# EAGLE board reprap (EAGLE 6.3)
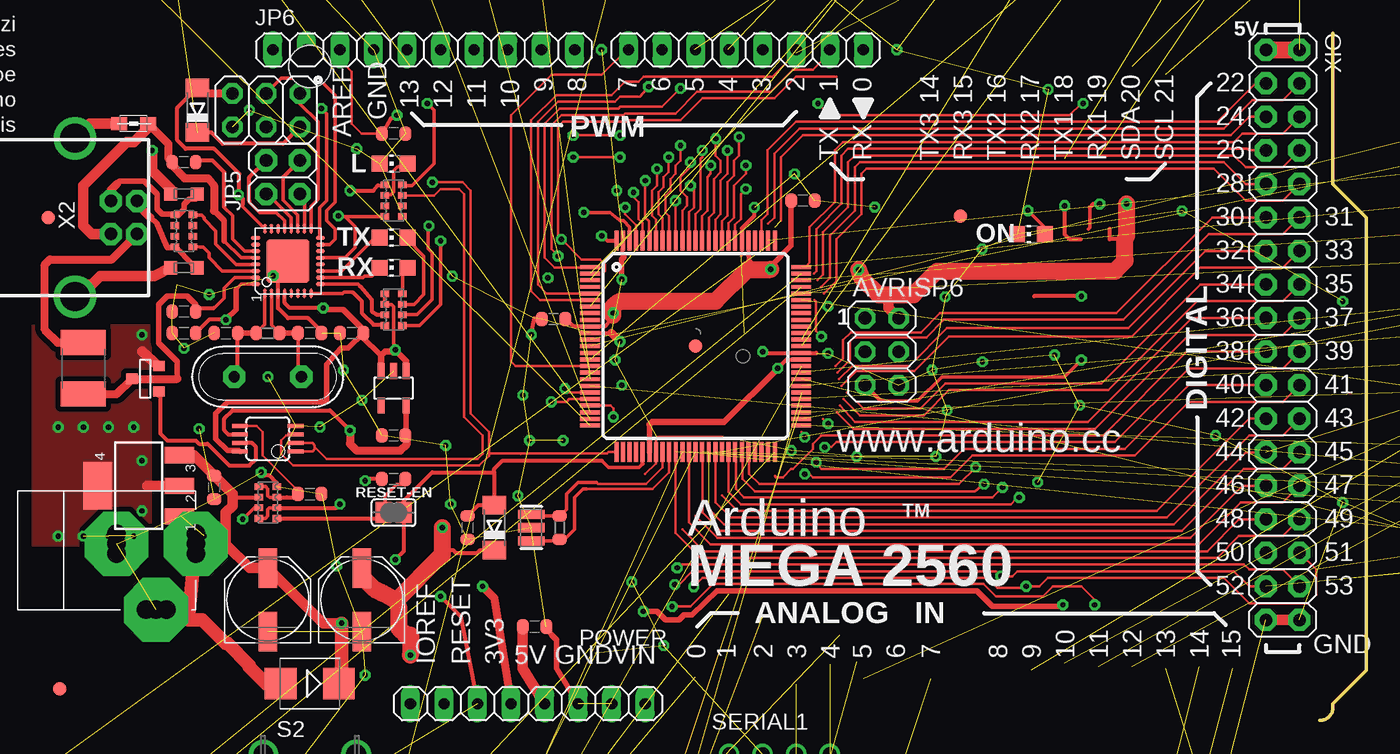
[diagram p5: board, top side]
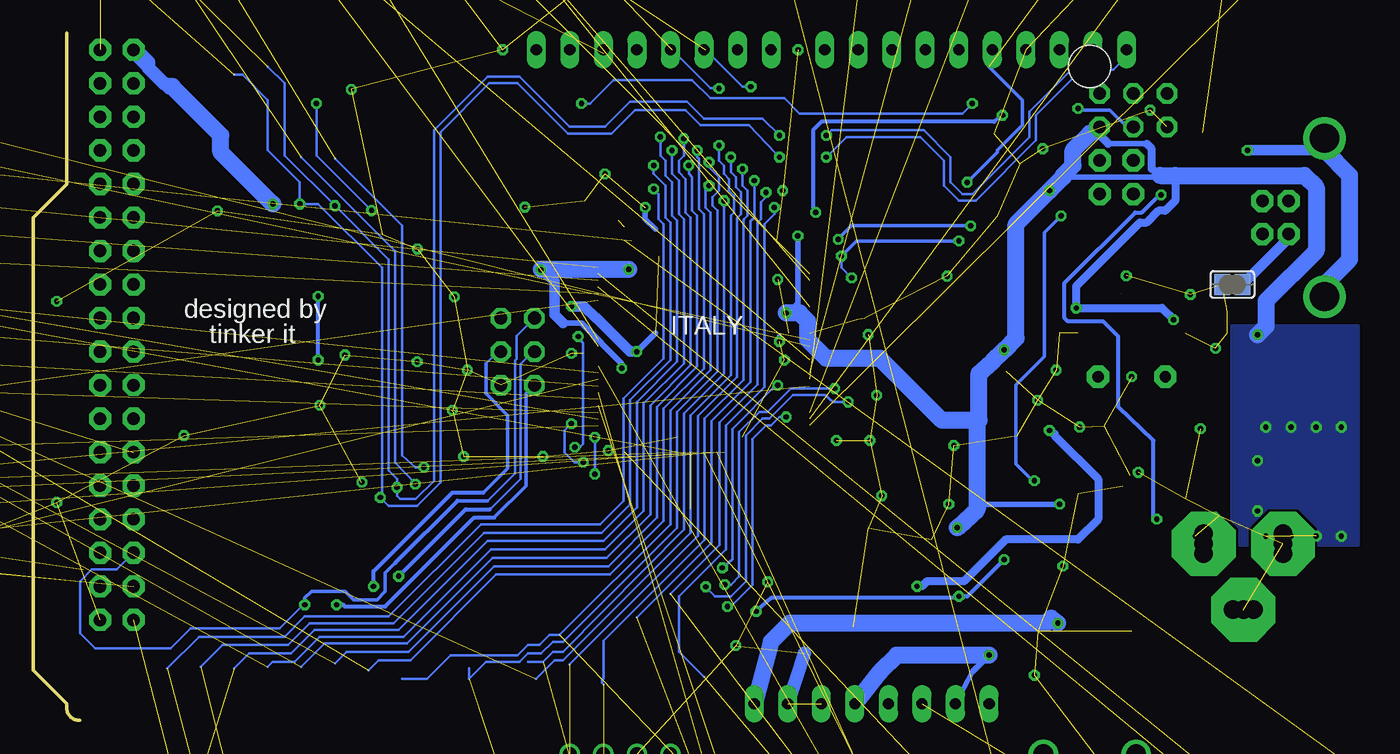
[diagram p6: board, bottom side, seen from below]

Size 3.54 x 52.07 mm. Coordinates in mm from the lower left corner, seen from the top.
Outline: 0,0 arc90 1,1 1,1.27 3.54,3.81 3.54,38.1 1,40.64 1,52.07
Copper layers (1*16): Top 0.035mm / dielectric 1.5mm / Bottom 0.035mm
Design rules "default": minimum track width 10mil, minimum drill 24mil, track to track 8mil, track to pad 8mil, pad to pad 8mil, via to via 8mil, smd to smd 8mil, copper to edge 40mil, drill to drill 8mil, minimum pad ring 10mil, minimum via ring 8mil, stop-mask expansion 4mil, vias tented up to drill 0mil, thermal gap 10mil
Net classes: 0 default: width 0.203 mm, drill 0.406 mm, clearance 0.203 mm; 1 power: width 0.61 mm, drill 0.406 mm, clearance 0.203 mm; 2 gnd: width 0.305 mm, drill 0.406 mm, clearance 0.203 mm; 3 power usb: width 0.508 mm, drill 0.406 mm, clearance 0.203 mm
Holes 3.2 mm at -76.47,49.53

## Footprints (pad centres in the part's own frame; a part is rotated, then mirrored left to right if it is on the bottom)
1X01 = drill 1.016 pad 1.93 octagon: 1 0,0
1X02 = drill 1.016 pad 1.88: 1 0,0; 2 2.54,0
1X04 = drill 1.016: 1 -2.54,0; 2 0,0; 3 2.54,0; 4 5.08,0
2X5 = drill 0.9 pad 1.422 octagon: 1 -3.81,-1.27; 2 -3.81,1.27; 3 -1.27,-1.27; 4 -1.27,1.27; 5 1.27,-1.27; 6 1.27,1.27; 7 3.81,-1.27; 8 3.81,1.27; 9 6.35,-1.27; 10 6.35,1.27
2X4 = drill 0.9 pad 1.422 octagon: 1 -3.81,-1.27; 2 -3.81,1.27; 3 -1.27,-1.27; 4 -1.27,1.27; 5 1.27,-1.27; 6 1.27,1.27; 7 3.81,-1.27; 8 3.81,1.27
1X18 = drill 1.016 pad 1.88 square: 1 0,0 | drill 1.016 pad 1.88: 2 2.54,0; 3 5.08,0; 4 7.62,0; 5 10.16,0; 6 12.7,0; 7 15.24,0; 8 17.78,0; 9 20.32,0; 10 22.86,0; 11 25.4,0; 12 27.94,0; 13 30.48,0; 14 33.02,0; 15 35.56,0; 16 38.1,0; 17 40.64,0; 18 43.18,0
2X03 = drill 0.95 pad 1.55 octagon: 1 -2.54,-1.27; 2 -2.54,1.27; 3 0,-1.27; 4 0,1.27; 5 2.54,-1.27; 6 2.54,1.27
C0603-ROUND = smd 0.898 x 1.1: 1 -0.889,0; 2 0.889,0
153CLV-0605 = smd 3.5 x 1.6: + 2.7,0; - -2.7,0
C0805 = smd 1.3 x 1.5: 1 -0.85,0; 2 0.85,0
153CLV-0405 = smd 2.6 x 1.6: + 1.8,0; - -1.8,0
SMB = smd 2.4 x 2.4: A 2.2,0; C -2.2,0
MINIMELF = smd 1.4 x 1.8: A 1.7,0; C -1.7,0
DO41-10 = drill 1.118: A 5.08,0; C -5.08,0
L1812 = smd 1.9 x 3.4: 1 -1.95,0; 2 1.95,0
MFR500 = drill 1.2 pad 2.3 long: 1 -5.08,0; 2 5.08,0
MFR1100 = drill 1.2 pad 2.3 long: 1 -5.08,0; 2 5.08,0
FIDUCIA-MOUNT = smd 1.016 x 1.016: P$1 0,0
SJ = smd 1.168 x 1.6: 1 -0.762,0; 2 0.762,0
SOT223 = smd 1.219 x 2.235: 1 -2.311,-3.099; 2 0,-3.099; 3 2.311,-3.099 | smd 3.6 x 2.2: 4 0,3.099
SO16 = smd 0.66 x 2.032: 1 -4.445,-3.073; 2 -3.175,-3.073; 3 -1.905,-3.073; 4 -0.635,-3.073; 5 0.635,-3.073; 6 1.905,-3.073; 7 3.175,-3.073; 8 4.445,-3.073; 9 4.445,3.073; 10 3.175,3.073; 11 1.905,3.073; 12 0.635,3.073; 13 -0.635,3.073; 14 -1.905,3.073; 15 -3.175,3.073; 16 -4.445,3.073
TQFP100 = smd 1.5 x 0.3: 1 -8,6; 2 -8,5.5; 3 -8,5; 4 -8,4.5; 5 -8,4; 6 -8,3.5; 7 -8,3; 8 -8,2.5; 9 -8,2; 10 -8,1.5; 11 -8,1; 12 -8,0.5; 13 -8,0; 14 -8,-0.5; 15 -8,-1; 16 -8,-1.5; 17 -8,-2; 18 -8,-2.5; 19 -8,-3; 20 -8,-3.5; 21 -8,-4; 22 -8,-4.5; 23 -8,-5; 24 -8,-5.5; 25 -8,-6; 51 8,-6; 52 8,-5.5; 53 8,-5; 54 8,-4.5; 55 8,-4; 56 8,-3.5; 57 8,-3; 58 8,-2.5; 59 8,-2; 60 8,-1.5; 61 8,-1; 62 8,-0.5; 63 8,0; 64 8,0.5; 65 8,1; 66 8,1.5; 67 8,2; 68 8,2.5; 69 8,3; 70 8,3.5; 71 8,4; 72 8,4.5; 73 8,5; 74 8,5.5; 75 8,6 | smd 0.3 x 1.5: 26 -6,-8; 27 -5.5,-8; 28 -5,-8; 29 -4.5,-8; 30 -4,-8; 31 -3.5,-8; 32 -3,-8; 33 -2.5,-8; 34 -2,-8; 35 -1.5,-8; 36 -1,-8; 37 -0.5,-8; 38 0,-8; 39 0.5,-8; 40 1,-8; 41 1.5,-8; 42 2,-8; 43 2.5,-8; 44 3,-8; 45 3.5,-8; 46 4,-8; 47 4.5,-8; 48 5,-8; 49 5.5,-8; 50 6,-8; 76 6,8; 77 5.5,8; 78 5,8; 79 4.5,8; 80 4,8; 81 3.5,8; 82 3,8; 83 2.5,8; 84 2,8; 85 1.5,8; 86 1,8; 87 0.5,8; 88 0,8; 89 -0.5,8; 90 -1,8; 91 -1.5,8; 92 -2,8; 93 -2.5,8; 94 -3,8; 95 -3.5,8; 96 -4,8; 97 -4.5,8; 98 -5,8; 99 -5.5,8; 100 -6,8
MLF32 = smd 0.7 x 0.28: 1 -2.45,1.75; 2 -2.45,1.25; 3 -2.45,0.75; 4 -2.45,0.25; 5 -2.45,-0.25; 6 -2.45,-0.75; 7 -2.45,-1.25; 8 -2.45,-1.75; 17 2.45,-1.75; 18 2.45,-1.25; 19 2.45,-0.75; 20 2.45,-0.25; 21 2.45,0.25; 22 2.45,0.75; 23 2.45,1.25; 24 2.45,1.75 | smd 0.28 x 0.7: 9 -1.75,-2.45; 10 -1.25,-2.45; 11 -0.75,-2.45; 12 -0.25,-2.45; 13 0.25,-2.45; 14 0.75,-2.45; 15 1.25,-2.45; 16 1.75,-2.45; 25 1.75,2.45; 26 1.25,2.45; 27 0.75,2.45; 28 0.25,2.45; 29 -0.25,2.45; 30 -0.75,2.45; 31 -1.25,2.45; 32 -1.75,2.45 | smd 3.254 x 3.254: 33 0,0
TQFP32-08 = smd 1.27 x 0.559: 1 -4.293,2.8; 2 -4.293,2; 3 -4.293,1.2; 4 -4.293,0.4; 5 -4.293,-0.4; 6 -4.293,-1.2; 7 -4.293,-2; 8 -4.293,-2.8; 17 4.293,-2.8; 18 4.293,-2; 19 4.293,-1.2; 20 4.293,-0.4; 21 4.293,0.4; 22 4.293,1.2; 23 4.293,2; 24 4.293,2.8 | smd 0.559 x 1.27: 9 -2.8,-4.293; 10 -2,-4.293; 11 -1.2,-4.293; 12 -0.4,-4.293; 13 0.4,-4.293; 14 1.2,-4.293; 15 2,-4.293; 16 2.8,-4.293; 25 2.8,4.293; 26 2,4.293; 27 1.2,4.293; 28 0.4,4.293; 29 -0.4,4.293; 30 -1.2,4.293; 31 -2,4.293; 32 -2.8,4.293
SOT23-DBV = smd 0.55 x 1.2: 1 -0.95,-1.3; 2 0,-1.3; 3 0.95,-1.3; 4 0.95,1.3; 5 -0.95,1.3
MSOP08 = smd 0.3 x 1.2: 1 -0.976,-2.113; 2 -0.326,-2.113; 3 0.324,-2.113; 4 0.974,-2.113; 5 0.974,2.112; 6 0.324,2.112; 7 -0.326,2.112; 8 -0.976,2.112
2X02 = drill 0.95 pad 1.676 octagon: 1 -1.27,-1.27; 2 -1.27,1.27; 3 1.27,-1.27; 4 1.27,1.27
1X10 = drill 0.85 pad 1.422 long: 1 -11.43,0; 2 -8.89,0; 3 -6.35,0; 4 -3.81,0; 5 -1.27,0; 6 1.27,0; 7 3.81,0; 8 6.35,0; 9 8.89,0; 10 11.43,0
2X03' = drill 1.016 octagon: 1 -2.54,-1.27; 2 -2.54,1.27; 3 0,-1.27; 4 0,1.27; 5 2.54,-1.27; 6 2.54,1.27
1X06 = drill 0.9 pad 1.422: 1 0,0; 2 2.54,0; 3 5.08,0; 4 7.62,0; 5 10.16,0; 6 12.7,0
CHIP-LED0805 = smd 1.2 x 1.2: A 0,-1.05; C 0,1.05
0805 = smd 1.2 x 1: 1 -1.1,0; 2 1.1,0
PANASONIC_D = smd 3 x 1.4: + 2.4,0; - -2.4,0
1X08 = drill 0.85 pad 1.422 long: 1 -8.89,0; 2 -6.35,0; 3 -3.81,0; 4 -1.27,0; 5 1.27,0; 6 3.81,0; 7 6.35,0; 8 8.89,0
TO220BV = drill 1.016 long: D 0,-2.54; G -2.54,-2.54; S 2.54,-2.54
R0603-ROUND = smd 0.898 x 1.1: 1 -0.889,0; 2 0.889,0
R0805 = smd 1.1 x 1.4: 1 -1,0; 2 1,0
R0805' = smd 1.3 x 1.5: 1 -0.85,0; 2 0.85,0
M0805 = smd 1.3 x 1.6: 1 -0.95,0; 2 0.95,0
CAY16 = smd 0.5 x 0.65: 1 -1.2,-0.675; 2 -0.4,-0.675; 3 0.4,-0.675; 4 1.2,-0.675; 5 1.2,0.675; 6 0.4,0.675; 7 -0.4,0.675; 8 -1.2,0.675
CAT16 = smd 0.5 x 0.65: 1 -1.2,-0.675; 2 -0.4,-0.675; 3 0.4,-0.675; 4 1.2,-0.675; 5 1.2,0.675; 6 0.4,0.675; 7 -0.4,0.675; 8 -1.2,0.675
B3F-31XX = drill 1.016 octagon: 1 -2.261,-1.245; 2 2.261,-1.245 | drill 1.499 pad 2.159: 3 -3.505,1.245; 4 3.505,1.245
3PIN-HEADER = drill 1.016: 1 -2.54,0; 2 0,0; 3 2.54,0
FE12 = drill 0.813 long: 1 -13.97,0; 2 -11.43,0; 3 -8.89,0; 4 -6.35,0; 5 -3.81,0; 6 -1.27,0; 7 1.27,0; 8 3.81,0; 9 6.35,0; 10 8.89,0; 11 11.43,0; 12 13.97,0
SOT-23 = smd 0.787 x 0.889: 1 0.025,-1.016; 2 -0.94,1.016; 3 0.991,1.016
ARDUINO_MEGA_SHIELD = drill 1 pad 1.422: 3.3V 50.8,26.67; 5V@0 50.8,29.21; 5V@1 2.54,85.09; 5V@2 2.54,87.63; A0 50.8,41.91; A1 50.8,44.45; A2 50.8,46.99; A3 50.8,49.53; A4 50.8,52.07; A5 50.8,54.61; A6 50.8,57.15; A7 50.8,59.69; A8 50.8,64.77; A9 50.8,67.31; A10 50.8,69.85; A11 50.8,72.39; A12 50.8,74.93; A13 50.8,77.47; A14 50.8,80.01; A15 50.8,82.55; AREF 2.54,14.986; D2 2.54,49.53; D3 2.54,46.99; D4 2.54,44.45; D5 2.54,41.91; D6 2.54,39.37; D7 2.54,36.83; D8 2.54,32.766; D9 2.54,30.226; D10 2.54,27.686; D11 2.54,25.146; D12 2.54,22.606; D13 2.54,20.066; D14 2.54,59.69; D15 2.54,62.23; D16 2.54,64.77; D17 2.54,67.31; D18 2.54,69.85; D19 2.54,72.39; D20 2.54,74.93; D21 2.54,77.47; D22 5.08,85.09; D23 5.08,87.63; D24 7.62,85.09; D25 7.62,87.63; D26 10.16,85.09; D27 10.16,87.63; D28 12.7,85.09; D29 12.7,87.63; D30 15.24,85.09; D31 15.24,87.63; D32 17.78,85.09; D33 17.78,87.63; D34 20.32,85.09; D35 20.32,87.63; D36 22.86,85.09; D37 22.86,87.63; D38 25.4,85.09; D39 25.4,87.63; D40 27.94,85.09; D41 27.94,87.63; D42 30.48,85.09; D43 30.48,87.63; D44 33.02,85.09; D45 33.02,87.63; D46 35.56,85.09; D47 35.56,87.63; D48 38.1,85.09; D49 38.1,87.63; D50 40.64,85.09; D51 40.64,87.63; D52 43.18,85.09; D53 43.18,87.63; GND@0 50.8,31.75; GND@1 50.8,34.29; GND@2 2.54,17.526; GND@3 45.72,85.09; GND@4 45.72,87.63; RES 50.8,24.13; RX 2.54,54.61; TX 2.54,52.07; VIN 50.8,36.83 | hole 3.2: 2.54,81.28; 50.8,87.63; 50.8,6.35
282837-6 = drill 1.2 long: P$1 0,-12.7; P$2 0,-7.62; P$3 0,-2.54; P$4 0,2.54; P$5 0,7.62; P$6 0,12.7
A4988BREAKOUT = drill 0.9: 1A 8.89,1.27; 1B 11.43,1.27; 2A 6.35,1.27; 2B 3.81,1.27; DIR 16.51,-11.43; EN -1.27,-11.43; GND 16.51,1.27; GND@0 1.27,1.27; MS1 1.27,-11.43; MS2 3.81,-11.43; MS3 6.35,-11.43; RST 8.89,-11.43; SLP 11.43,-11.43; STEP 13.97,-11.43; VDD 13.97,1.27; VMOT -1.27,1.27
POWERSUPPLY_DC-21MM = drill 1.4 pad 4.826 octagon: 1 -5.08,-3.353; 2 -0.076,-6.35; 3 -0.076,-0.356 | drill 1.4: 4 -5.08,-4.115; 5 -5.08,-2.591; 6 -0.838,-0.356; 7 0.686,-0.356; 8 -0.838,-6.35; 9 0.686,-6.35
PN61729 = drill 0.95 pad 1.676 octagon: 1 1.25,4.71; 2 -1.25,4.71; 3 -1.25,2.71; 4 1.25,2.71 | drill 2.2: P$1 -6,0; P$2 6,0
MSTBA4 = drill 1.397 long: 1 -7.62,5.08; 2 -2.54,5.08; 3 2.54,5.08; 4 7.62,5.08
2X18 = drill 0.95 pad 1.676 octagon: 1 -21.59,-1.27; 2 -21.59,1.27; 3 -19.05,-1.27; 4 -19.05,1.27; 5 -16.51,-1.27; 6 -16.51,1.27; 7 -13.97,-1.27; 8 -13.97,1.27; 9 -11.43,-1.27; 10 -11.43,1.27; 11 -8.89,-1.27; 12 -8.89,1.27; 13 -6.35,-1.27; 14 -6.35,1.27; 15 -3.81,-1.27; 16 -3.81,1.27; 17 -1.27,-1.27; 18 -1.27,1.27; 19 1.27,-1.27; 20 1.27,1.27; 21 3.81,-1.27; 22 3.81,1.27; 23 6.35,-1.27; 24 6.35,1.27; 25 8.89,-1.27; 26 8.89,1.27; 27 11.43,-1.27; 28 11.43,1.27; 29 13.97,-1.27; 30 13.97,1.27; 31 16.51,-1.27; 32 16.51,1.27; 33 19.05,-1.27; 34 19.05,1.27; 35 21.59,-1.27; 36 21.59,1.27
RESONATOR = smd 0.7 x 2: 1 -1,0; 2 0,0; 3 1,0
QS = drill 0.85 pad 1.676 octagon: 1 -2.54,0; 2 2.54,0
CT/CN0603 = smd 1 x 1: 1 -1,0; 2 1,0

## Placement (x,y rotation side)
5V1  [1X01]  -100.6,80.01 0 top  (outside the outline)
12V-AUX1  [1X02]  -94.25,87.63 0 top  (outside the outline)
A-OUT1  [1X04]  -38.37,55.88 0 top  (outside the outline)
AUX-2  M05X2  [2X5]  32.75,34.29 0 top  (outside the outline)
AUX-3  M04X2  [2X4]  35.29,15.24 0 top  (outside the outline)
AUX-4  M18_  [1X18]  23.86,5.08 90 top  (outside the outline)
AVRISP6  3x2M  [2X03]  -33.16,27.94 270 top  (outside the outline)
C1  22p  [C0603-ROUND]  -64.53,14.6 270 top  (outside the outline)
C2  100n  [C0603-ROUND]  -83.71,17.65 270 top  (outside the outline)
C3  100n  [C0603-ROUND]  -70.12,44.45 0 top  (outside the outline)
C4  100n  [C0603-ROUND]  -59.45,7.11 0 top  (outside the outline)
C5  100n  [C0603-ROUND]  -39.13,39.37 0 top  (outside the outline)
C6  100n  [C0603-ROUND]  -58.02,30.42 180 top  (outside the outline)
C7  100n  [C0603-ROUND]  -70.12,18.29 0 top  (outside the outline)
C8  100n  [C0603-ROUND]  -86,30.99 180 top  (outside the outline)
C9  100n  [C0603-ROUND]  -86,29.34 180 top  (outside the outline)
C10  1u  [C0603-ROUND]  -86,42.29 180 top  (outside the outline)
C11  100n  [C0603-ROUND]  -73.3,29.34 0 top  (outside the outline)
C12  100n  [C0603-ROUND]  -76.47,17.15 180 top  (outside the outline)
C13  1u  [C0603-ROUND]  -70.12,21.59 0 top  (outside the outline)
C14  22p  [C0603-ROUND]  -82.82,29.34 180 top  (outside the outline)
C15  22p  [C0603-ROUND]  -76.47,29.34 0 top  (outside the outline)
C16  100uF  [153CLV-0605]  -89.17,107.95 0 top  (outside the outline)
C17  100nF  [C0805]  -100.6,83.82 0 top  (outside the outline)
C18  100uF  [153CLV-0605]  -92.98,-74.93 0 top  (outside the outline)
C19  100uF  [153CLV-0605]  -82.82,-74.93 0 top  (outside the outline)
C20  100uF  [153CLV-0605]  -72.66,-74.93 0 top  (outside the outline)
C26  10uF  [153CLV-0405]  -15.51,-13.97 0 top  (outside the outline)
C27  10uF  [153CLV-0405]  -7.89,-13.97 0 top  (outside the outline)
C28  10uF  [153CLV-0405]  -15.51,-22.86 0 top  (outside the outline)
C29  100uF  [153CLV-0605]  -114.57,-90.17 0 top  (outside the outline)
C30  100uF  [153CLV-0605]  -104.41,-90.17 0 top  (outside the outline)
D1  M7  [SMB]  -76.47,2.79 180 top  (outside the outline)
D2  CD1206-S01575  [MINIMELF]  -84.98,46.23 90 top  (outside the outline)
D3  CD1206-S01575  [MINIMELF]  -62.5,14.6 90 top  (outside the outline)
D6  1N4004  [DO41-10]  -91.71,92.71 0 top  (outside the outline)
D7  1N4004  [DO41-10]  -110.76,85.09 0 top  (outside the outline)
E0-MOT1  [1X04]  -99.33,-107.95 0 top  (outside the outline)
E1-MOT1  [1X04]  -87.9,-107.95 0 top  (outside the outline)
F1  MF-MSMF050-2 500mA  [L1812]  -93.61,26.67 90 top  (outside the outline)
F4  MFR500  [MFR500]  -108.22,90.17 0 top  (outside the outline)
F5  MFR1100  [MFR1100]  -105.68,95.25 0 top  (outside the outline)
FD1  FIDUCIALMOUNT  [FIDUCIA-MOUNT]  -27.22,38.19 0 top  (outside the outline)
FD2  FIDUCIALMOUNT  [FIDUCIA-MOUNT]  -95.39,2.41 0 top  (outside the outline)
FD3  FIDUCIALMOUNT  [FIDUCIA-MOUNT]  -96.28,38.1 0 top  (outside the outline)
FD4  FIDUCIALMOUNT  [FIDUCIA-MOUNT]  -47.26,28.35 0 top  (outside the outline)
GROUND  [SJ]  -87.27,33.02 180 bottom  (outside the outline)
I2C1  [1X04]  4.81,71.12 0 top  (outside the outline)
IC1  NCP1117ST50T3G  [SOT223]  -89.42,17.78 90 top  (outside the outline)
IC2  74HC4050D  [SO16]  31.48,-26.67 0 top  (outside the outline)
IC3  ATMEGA2560-16AU  [TQFP100]  -47.26,28.35 0 top  (outside the outline)
IC4  ATMEGA16U2-MU  [MLF32]  -78.12,34.8 90 top  (outside the outline)
IC5  MEGA8-AI  [TQFP32-08]  -139.97,-109.22 0 top  (outside the outline)
IC6  LP2985-33DBVR  [SOT23-DBV]  -70.12,25.17 180 top  (outside the outline)
IC7  LMV358IDGKR  [MSOP08]  -79.64,21.34 90 top  (outside the outline)
ICSP1  3x2M  [2X03]  -79.77,46.23 180 top  (outside the outline)
JP5  2x2M - NM  [2X02]  -78.5,41.15 90 top  (outside the outline)
JP6  10x1F-H8.5  [1X10]  -67.83,50.8 0 top  (outside the outline)
JP8  [2X03']  -95.52,-88.9 0 top  (outside the outline)
JP9  [1X06]  -20.59,-26.67 180 top  (outside the outline)
JP10  [2X03']  -86.63,-88.9 0 top  (outside the outline)
JP11  [2X03']  -77.74,-88.9 0 top  (outside the outline)
JP12  [2X03']  -68.85,-88.9 0 top  (outside the outline)
JP13  [2X03']  -114.57,-101.6 0 top  (outside the outline)
L  YELLOW  [CHIP-LED0805]  -70.12,42.16 90 top  (outside the outline)
L1  BLM21  [0805]  -89.8,45.21 180 top  (outside the outline)
LED1  [CHIP-LED0805]  -80.28,60.96 180 top  (outside the outline)
LED5  [CHIP-LED0805]  -52.34,59.69 0 top  (outside the outline)
LED6  [CHIP-LED0805]  -47.26,59.69 0 top  (outside the outline)
LED7  [CHIP-LED0805]  -42.18,59.69 0 top  (outside the outline)
ON  GREEN  [CHIP-LED0805]  -21.86,36.83 90 top  (outside the outline)
PC1  47u  [PANASONIC_D]  -79.64,9.14 90 top  (outside the outline)
PC2  47u  [PANASONIC_D]  -72.53,9.14 90 top  (outside the outline)
POWER  8x1F-H8.5  [1X08]  -59.96,1.27 0 top  (outside the outline)
PS-ON1  [1X01]  -113.3,80.01 0 top  (outside the outline)
PWML  8x1F-H8.5  [1X08]  -43.45,50.8 180 top  (outside the outline)
Q4  STP55NF06L  [TO220BV]  -61.23,97.79 0 top  (outside the outline)
Q5  STP55NF06L  [TO220BV]  -65.04,78.74 0 top  (outside the outline)
Q6  STP55NF06L  [TO220BV]  -52.34,78.74 0 top  (outside the outline)
R1  1M  [R0603-ROUND]  -57.55,14.6 90 top  (outside the outline)
R2  1M  [R0603-ROUND]  -79.64,29.34 0 top  (outside the outline)
R3  100k  [R0805]  -43.45,76.2 0 top  (outside the outline)
R4  100k  [R0805]  -108.22,-99.06 0 top  (outside the outline)
R5  100k  [R0805]  -101.87,-99.06 0 top  (outside the outline)
R7  100k  [R0805]  -68.85,67.31 0 top  (outside the outline)
R9  100k  [R0805]  -95.52,-99.06 0 top  (outside the outline)
R13  100k  [R0805]  -62.5,67.31 0 top  (outside the outline)
R14  1K  [R0805]  -76.47,60.96 270 top  (outside the outline)
R15  100k  [R0805]  -89.17,-99.06 0 top  (outside the outline)
R16  100k  [R0805]  -82.82,-99.06 0 top  (outside the outline)
R17  10k  [R0805]  -76.47,-99.06 0 top  (outside the outline)
R23  4.7K  [R0805]  -9.16,-21.59 0 top  (outside the outline)
R24  4.7K  [R0805]  -2.81,-21.59 0 top  (outside the outline)
R25  10k  [R0805]  -71.39,-99.06 0 top  (outside the outline)
R26  10k  [R0805]  -117.11,-107.95 0 top  (outside the outline)
R27  10k  [R0805]  -112.03,-107.95 0 top  (outside the outline)
R28  4.7K  [R0805]  2.27,64.77 0 top  (outside the outline)
R29  4.7K  [R0805]  7.35,64.77 270 top  (outside the outline)
R30  4.7K  [R0805]  -16.78,-30.48 0 top  (outside the outline)
R31  10r  [R0805']  -68.85,60.96 0 top  (outside the outline)
R32  10r  [M0805]  -58.69,60.96 0 top  (outside the outline)
R33  10r  [R0805']  -63.77,60.96 0 top  (outside the outline)
R34  1.8K  [R0805]  -56.15,67.31 0 top  (outside the outline)
R35  1.8K  [R0805]  -49.8,67.31 0 top  (outside the outline)
R36  1.8K  [R0805]  -43.45,67.31 0 top  (outside the outline)
R37  10k  [R0805]  -106.95,-107.95 0 top  (outside the outline)
RESET-EN  [SJ]  -70.12,15.75 0 top  (outside the outline)
RN2  22R  [CAY16]  -86,37.08 90 top  (outside the outline)
RN3  1k  [CAY16]  -70.12,39.37 270 top  (outside the outline)
RN4  1k  [CAY16]  -70.12,31.12 90 top  (outside the outline)
RN5  10K  [CAT16]  -79.64,16.51 90 top  (outside the outline)
RX  YELLOW  [CHIP-LED0805]  -70.12,34.29 90 top  (outside the outline)
S2  [B3F-31XX]  -76.47,-3.81 0 top  (outside the outline)
SER0  [3PIN-HEADER]  -87.9,64.77 90 top  (outside the outline)
SER1  [3PIN-HEADER]  -1.54,74.93 0 top  (outside the outline)
SER2  [3PIN-HEADER]  -11.7,76.2 0 top  (outside the outline)
SER3  [3PIN-HEADER]  -23.13,76.2 0 top  (outside the outline)
SERIAL1  [1X04]  -42.18,-2.54 0 top  (outside the outline)
SV1  [FE12]  -139.97,-57.15 90 top  (outside the outline)
T1  FDN340P  [SOT-23]  -88.92,25.91 270 top  (outside the outline)
TX  YELLOW  [CHIP-LED0805]  -70.12,36.58 90 top  (outside the outline)
U1  ARDUINO_MEGA_SHIELD  [ARDUINO_MEGA_SHIELD]  -199.66,-102.87 0 top  (outside the outline)
U$1  282837-6  [282837-6]  -58.69,87.63 90 top  (outside the outline)
U$2  A4988BREAKOUT  [A4988BREAKOUT]  -132.35,-19.05 0 top  (outside the outline)
U$3  A4988BREAKOUT  [A4988BREAKOUT]  -72.66,-22.86 0 top  (outside the outline)
U$9  A4988BREAKOUT  [A4988BREAKOUT]  -106.95,-39.37 0 top  (outside the outline)
U$10  A4988BREAKOUT  [A4988BREAKOUT]  -67.58,-50.8 0 top  (outside the outline)
U$11  A4988BREAKOUT  [A4988BREAKOUT]  -103.14,-53.34 0 top  (outside the outline)
VCC1  [1X01]  -106.95,80.01 0 top  (outside the outline)
X1  POWERSUPPLY_DC21MMX  [POWERSUPPLY_DC-21MM]  -91.46,13.46 90 top  (outside the outline)
X2  USB-B_TH  [PN61729]  -94.25,38.1 270 top  (outside the outline)
X3  MSTBA4  [MSTBA4]  -105.68,104.14 0 top  (outside the outline)
X+1  [3PIN-HEADER]  -24.4,60.96 90 top  (outside the outline)
X-1  [3PIN-HEADER]  -29.48,66.04 90 top  (outside the outline)
X-MOT1  [1X04]  -76.47,-107.95 0 top  (outside the outline)
XIO  18x2F-H8.5  [2X18]  -2.81,29.21 270 top
Y1  CSTCE16M0V53-R0 16MHZ  [RESONATOR]  -59.71,14.6 270 top  (outside the outline)
Y2  16MHz  [QS]  -79.64,26.03 180 top  (outside the outline)
Y+1  [3PIN-HEADER]  -16.78,60.96 90 top  (outside the outline)
Y-1  [3PIN-HEADER]  -18.05,66.04 90 top  (outside the outline)
Y-MOT1  [1X04]  -114.57,-114.3 0 top  (outside the outline)
Z1  CG0603MLC-05E  [CT/CN0603]  -86,34.29 0 top  (outside the outline)
Z2  CG0603MLC-05E  [CT/CN0603]  -86,39.88 0 top  (outside the outline)
Z+1  [3PIN-HEADER]  -2.81,66.04 90 top  (outside the outline)
Z-1  [3PIN-HEADER]  -6.62,66.04 90 top  (outside the outline)
Z-MOT2  [1X04]  -103.14,-114.3 0 top  (outside the outline)
Z-MOT3  [1X04]  -91.71,-114.3 0 top  (outside the outline)

## Tracks (layer width: path | path; a pad name or v marks a point on that pad's centre or on a via)
8PB4
  Top 0.254: -77.49,39.88 JP5.1 -76.87,39.52 IC4.18
8PB5
  Top 0.254: -78.5,41.15 -78.5,39.42 -77.37,38.29 IC4.19
  Top 0.305: -78.5,41.15 JP5.3
8PB6
  Top 0.254: IC4.20 -77.87,38.1 -79.64,39.88 JP5.2
8PB7
  Top 0.254: IC4.21 -78.38,37.85 -79.01,38.48 -80.28,38.48 -81.04,39.24 -81.04,39.37
  Top 0.305: -81.04,39.37 -81.04,41.15 JP5.4
+3V3  (via drill 0.41)
  Top 0.305: IC7.6 -82.64,21.66 -82.95,21.97 -82.95,22.86 -82.31,23.5 -74.95,23.5 v-73.42,21.97
  Top 0.406: -69.17,21.62 IC6.5
  Top 0.61: POWER.4 -62.5,9.27 v-63.39,10.16 | -69.17,21.62 C13.2 -69.1,21.55 -69.1,20.95 -69.61,20.45 -72.91,20.45 -73.42,20.95 v-73.42,21.97
  Bottom 0.61: v-63.39,10.16 -63.77,10.16 -64.15,10.54 -66.94,10.54 -70.12,13.72 -75.58,13.72 -77.1,15.24 -77.1,18.29 -73.8,21.59 -73.8,21.72 v-73.42,21.97
+5V  (via drill 0.41)  (7 unrouted)
  Top 0.254: IC3.80 -43.25,36.3 -43.27,36.27 -43.25,36.25 -43.25,35.41 | -40.4,27.31 -40.36,27.35 | v-69.99,28.07 -70.06,28.19 -70.12,28.64 -70.12,31.37 -70.27,31.51 RN4.6 RN4.5 | RN5.8 -79.83,15.31 -79.64,15.49 -79.64,16 -79.54,16.11 RN5.2 | IC4.32 -81.65,33.05 -82.06,32.64
  Top 0.305: -43.2,34.67 -43.2,35.1 -43.25,35.15 -43.25,35.41 | -40.36,27.35 IC3.61 | v-41.04,26.67 -40.4,27.31 | -53.61,30.48 -54.12,29.85 IC3.10 -56.46,29.85 C6.1 | IC3.100 -53.89,36.35 v-54.37,36.7 | -14.75,36.45 -15.89,36.45 | v-73.42,40.13 -71.64,40.13 -71.32,40.51 RN3.1 | -15.89,36.45 -15.91,36.43 | -15.89,36.45 -15.89,37.21 -15.91,37.23 | C9.1 -84.09,30.35 v-82.82,30.35 | RN5.2 -74.46,16.11 v-74.18,16.38 | IC4.4 -78.37,31.62 -77.99,31.24 v-75.45,31.24 | D2.C -83.91,44.53 -83.07,43.69 -78.5,43.69 ICSP1.2 | D3.C -63.56,12.91 -63.77,12.7 -65.42,12.7 -65.63,12.91 -66.13,12.91 -66.44,13.21
  Top 0.406: -53.51,30.7 -53.61,30.48 v-53.48,30.86 | -50.76,22.41 IC3.31 | C5.1 -40.02,35.97 -41.55,34.42 -41.57,34.39 v-41.57,34.16 | C11.2 -72.53,29.09 -71.07,27.62 | C11.2 -72.41,29.59 -73.93,31.12 -75.33,31.12 v-75.45,31.24 | C11.2 -73.55,28.19 -74.1,28.19 -75.2,26.96 -75.2,24.26 -75.45,24.13 -82.69,24.13 -83.58,23.24 -83.58,21.34 -82.69,20.45 -81.84,20.45 IC7.8 | -82.06,32.64 -82.06,31.12 v-82.82,30.35
  Top 0.508: -50.76,22.41 -50.56,22.61 -45.1,22.61 v-41.04,26.67 | -71.1,26.67 IC6.3 -71.07,27.62 -70.75,27.94 -70.12,27.94 | IC6.1 -69.17,27.24 v-69.99,28.07
  Top 0.61: v-69.99,28.07 -70.12,27.94 | -43.2,34.67 -43.2,34.29 -43.07,34.16
  Top 0.813: -88.79,17.78 IC1.2 | C4.1 -60.34,3.94 POWER.5 | -14.75,34.8 -14.75,34.92 | -32.65,32.26 -32.65,31.24 AVRISP6.2 | T1.2 -87.95,26.85 -89.17,27.94
  Top 1.27: XIO.1 XIO.2 | v-34.92,34.14 -34.69,33.53 -33.42,32.26 -32.65,32.26 -30.75,32.26 -28.97,34.04 -15.51,34.04 -14.75,34.8 | -14.75,34.92 -14.75,36.45 -14.62,36.7 v-14.62,39.12 | -53.51,30.7 -53.51,31.34 -52.97,31.75 -45.74,31.75 -43.32,34.16 -43.07,34.16 v-41.57,34.16 | v-66.44,14.6 -66.44,13.21 -66.44,12.57 -69.93,9.08 | v-68.85,4.95 -68.85,6.48 -69.23,6.48 -69.74,6.98 -69.74,8.51 -69.93,9.08 | PC2.+ -72.53,10.92 -71.52,9.91 -71.01,9.65 -69.93,9.08
  Bottom 0.406: v-53.48,30.86 -53.48,30.73 -54.37,31.62 v-54.37,36.7 | -36.59,30.1 -37.99,30.1 -41.04,27.05 v-41.04,26.67 | -74.56,41.15 -81.3,41.15 -81.42,41.28 -81.8,41.28 | -80.79,43.69 -77.87,43.69 | v-74.18,16.38 -67.96,16.38 | POWER.2 -67.58,3.68 v-68.85,4.95
  Bottom 0.61: -34.94,34.16 v-34.92,34.14 | -74.44,41.28 -74.56,41.15 | -81.8,41.28 -81.17,41.78 -81.17,43.31 -80.79,43.69 | -77.87,43.69 -77.23,44.32 ICSP1.2 | v-82.82,30.35 -81.93,31.24 v-75.45,31.24 -75.45,32.89 -80.28,37.72 -80.79,37.72 -81.68,38.61 -82.19,38.61 -82.95,39.37 -82.95,41.28
  Bottom 0.813: -36.59,30.1 -35.96,30.73 -35.96,33.27 v-34.92,34.14
  Bottom 1.016: -6.87,48.01 -6.37,48.26 -5.22,49.4 -5.1,49.78
  Bottom 1.27: v-68.85,4.95 -61.86,4.95 -60.59,3.68 POWER.5 | v-41.57,34.16 -34.94,34.16 | v-53.48,30.86 -54.5,30.86 -55.13,30.23 -55.13,28.83 -56.53,27.43 -60.59,27.43 -65.29,22.73 -67.96,22.73 | ICSP1.2 -77.1,44.83 -76.47,44.45 -75.2,43.18 -75.2,42.04 -74.44,41.28 -74.44,41.15 v-73.42,40.13 -70.88,37.59 -70.88,28.96 v-69.99,28.07 -69.1,27.18 -68.09,26.29 -68.09,22.73 -67.96,22.73 | -67.96,22.73 -67.96,16.38 -67.96,16 v-66.44,14.6 | v-14.62,39.12 -10.68,43.05 -10.68,44.32 -7,48.01 -6.87,48.01 | v-89.17,29.21 -89.8,29.84 -89.8,31.75 -93.61,35.56 -93.61,40.39 -92.73,41.28 -82.95,41.28 -81.8,41.28 | -5.1,49.78 XIO.1
  other vias: -91.71,22.22 -93.61,22.22 -89.8,22.22 -95.52,22.22 -89.17,19.69 -95.52,13.97 -91.71,13.97 -93.61,13.97 -89.17,15.88 -89.8,13.97
  pour Top (isolate 0.406, no thermals): -88.53,13.34 -88.53,29.84 -97.42,29.84 -97.42,13.34
  pour Bottom: -96.79,13.34 -96.79,29.84 -87.27,29.84 -87.27,13.34
+12V  (19 unrouted)
+12V2  (2 unrouted)
A3  (via drill 0.41)  (1 unrouted)
  Top 0.203: IC3.94 -50.26,37.92 -50.56,38.23 -50.56,40.13 -50.18,40.51 v-50.18,41.78
  Bottom 0.203: -39.64,2.74 -39.54,2.84 -39.54,3.05 -39.64,3.15 -39.64,6.02 -47.31,13.69 -47.31,22.86 -50.26,25.81 -50.26,37.85 -50.31,37.97 -50.56,38.23 -50.56,40.13 -50.18,40.51 v-50.18,41.78
A4  (via drill 0.41)  (1 unrouted)
  Top 0.203: IC3.93 -49.76,38.06 -50.05,38.35 -50.05,40 -49.67,40.39 -49.67,41.15 -49.29,41.53 v-49.29,42.67
  Bottom 0.203: -37.1,4.27 -46.8,13.97 -46.8,23.06 -49.75,26.01 -49.75,38.05 -50.05,38.35 -50.05,40 -49.67,40.39 -49.67,41.15 -49.29,41.53 v-49.29,42.67
A5  (via drill 0.41)  (1 unrouted)
  Top 0.203: IC3.92 -49.26,38.19 -49.55,38.48 -49.55,39.75 -49.16,40.13 -49.16,41.02 -48.78,41.4 -48.78,42.04 -48.4,42.42 v-48.4,43.56
  Bottom 0.203: v-48.4,43.56 -48.4,42.42 -48.78,42.04 -48.78,41.4 -49.16,41.02 -49.16,40.13 -49.55,39.75 -49.55,38.48 -49.29,38.23 -49.29,26.16 -46.24,23.11 -46.24,14.22 -36.59,4.57 -35.96,4.57 -34.56,3.17
A9  (via drill 0.41)  (1 unrouted)
  Top 0.203: IC3.88 -47.26,38.35 -46.88,38.73 -46.88,42.54 -46.75,42.67 v-46.75,43.18
  Bottom 0.203: v-46.75,43.18 -46.75,42.67 -46.88,42.54 -46.88,38.73 -47.26,38.35 -47.26,26.67 -44.21,23.62 -44.21,15.11 -40.15,11.05 -31.51,11.05 -25.03,4.57 -22.62,4.57 -21.86,3.81
A10  (via drill 0.41)  (1 unrouted)
  Top 0.203: IC3.87 -46.76,38.22 -46.37,38.61 -46.37,41.15 -46.12,41.4 v-46.12,42.04
  Bottom 0.203: v-46.12,42.04 -46.12,41.4 -46.37,41.15 -46.37,38.61 -46.75,38.23 -46.75,26.8 -43.7,23.75 -43.7,15.37 -40.02,11.68 -31.38,11.68 -24.91,5.21 -20.21,5.21 -19.32,4.32
A11  (via drill 0.41)  (1 unrouted)
  Top 0.203: IC3.86 -46.26,38.08 -45.86,38.48 -45.86,41.02 -45.35,41.53 -45.35,42.42 -45.74,42.8 v-45.74,44.07
  Bottom 0.203: v-45.74,44.07 -45.74,42.8 -45.35,42.42 -45.35,41.53 -45.86,41.02 -45.86,38.48 -46.24,38.1 -46.24,26.92 -43.2,23.88 -43.2,15.62 -39.89,12.32 -31.26,12.32 -24.78,5.84 -18.56,5.84 -16.78,4.06
A12  (via drill 0.41)  (1 unrouted)
  Top 0.203: IC3.85 -45.76,37.95 -45.35,38.35 -45.35,40.89 -44.85,41.4 v-44.85,43.18
  Bottom 0.203: v-44.85,43.18 -44.85,41.4 -45.35,40.89 -45.35,38.35 -45.74,37.97 -45.74,27.05 -42.69,24 -42.69,15.88 -39.77,12.95 -31.13,12.95 -24.53,6.35 -18.18,6.35 -16.27,4.44 -14.62,4.44 -14.24,4.06
AREF  (via drill 0.41)
  Top 0.203: C3.1 -72.53,44.45 -73.3,45.21 -73.3,49.15 -74.18,50.04 JP6.3
  Top 0.254: IC3.98 -52.26,37.38 -52.72,37.85 -52.97,37.85 -53.74,38.48 v-55.72,38.48
  Top 0.305: v-69.87,45.85 -70.33,45.59 C3.1
  Bottom 0.305: v-69.87,45.85 -69.23,45.34 -56.15,45.34 -55.52,44.7 -55.52,38.66 v-55.72,38.48
CMP
  Top 0.203: C12.2 -77.36,17.4 -80.03,20.07 -80.03,21.84 -80.49,22.31 IC7.5
  Top 0.254: -78.99,16.89 -79.52,16.89 -79.64,17.02 -79.64,17.53 -79.83,17.71 RN5.5
  Top 0.305: -78.99,16.89 RN5.3 | RN5.3 -78.19,16.91 | C12.2 -77.59,16.91 RN5.3
D1  (1 unrouted)
D2  (1 unrouted)
D4  (via drill 0.41)  (1 unrouted)
  Top 0.203: IC3.1 -55.33,34.35 -55.39,34.29 -57.93,34.29 -58.69,35.05 -58.69,45.21 -57.55,46.35 -53.1,46.35 -52.97,46.48 -49.8,46.48 v-48.4,47.88
  Bottom 0.203: -44.85,50.8 -47.77,47.88 v-48.4,47.88
D5  (via drill 0.41)  (1 unrouted)
  Top 0.203: IC3.5 -58.52,32.35 -59.2,33.02 -59.2,45.34 -57.67,46.86 -53.36,46.86 -52.97,47.24 -51.45,47.24 v-50.82,48.01
  Bottom 0.203: -47.39,50.8 -50.18,48.01 v-50.82,48.01
D6  (1 unrouted)
D8  (2 unrouted)
D9  (2 unrouted)
D10  (2 unrouted)
D11  (1 unrouted)
D12  (1 unrouted)
D16  (1 unrouted)
D17  (1 unrouted)
D23  (1 unrouted)
D25  (1 unrouted)
D27  (1 unrouted)
D29  (1 unrouted)
D31  (1 unrouted)
D32  (1 unrouted)
D33  (1 unrouted)
D35  (1 unrouted)
D37  (1 unrouted)
D39  (1 unrouted)
D40  (1 unrouted)
D41  (1 unrouted)
D42  (1 unrouted)
D43  (1 unrouted)
D44  (2 unrouted)
  Top 0.203: -46.26,16.02 -45.1,14.86 -11.06,14.86 -5.6,20.32 XIO.25
D45  (1 unrouted)
D47  (1 unrouted)
D49  (1 unrouted)
D53  (1 unrouted)
D+
  Top 0.406: -91.07,40.64 -90.86,40.85 -89,40.85 -88.03,39.88 -88.03,38.73 -87.65,38.35 -86.74,38.35 RN2.5 -86.45,38.28 -86,38.73 -86,39.12 -85.61,39.5 -85.12,39.5 Z2.2
  Top 0.61: X2.3 -91.54,40.17 -91.07,40.64
D-
  Top 0.406: -88.53,38.1 -88.5,38.1 -88.03,37.63 -88.03,37.59 -87.27,35.81 -86.74,35.81 RN2.8 -85.33,34.54 Z1.2
  Top 0.61: X2.2 -89.53,39.1 -88.53,38.1
DTR  (via drill 0.41)
  Top 0.254: -73.8,38.17 -74.25,38.17 v-74.31,38.23 | -73.8,38.17 RN3.4 | IC4.13 -73.81,35.05 -73.04,35.81 -73.04,37.41 -73.8,38.17
  Top 0.305: C7.1 -72.02,18.29 v-72.28,18.16
  Bottom 0.254: v-72.28,18.16 -72.15,18.16 -70.88,19.43 -70.88,25.4 -73.04,27.56 -73.04,36.96 v-74.31,38.23
E0-DIR  (1 unrouted)
E0-EN  (2 unrouted)
E0-STEP  (1 unrouted)
E1-DIR  (1 unrouted)
E1-EN  (2 unrouted)
E1-STEP  (1 unrouted)
GATE_CMD
  Top 0.305: T1.3 -87.77,24.79 -87.77,21.72 -87.27,21.21 -85.11,21.21 -84.85,20.95 -84.22,20.95 -82.57,19.3 -81.04,19.3 -80.53,19.81 -80.53,20.7 -80.84,21.01 IC7.7
  Top 0.406: T1.3 -87.9,24.64
GND  (via drill 0.41)  (140 unrouted)
  Top 0.203: -43.83,35.18 -43.76,35.25 IC3.81 -43.73,36.35 | -43.76,37.28 -43.76,36.38 -43.73,36.35 | IC3.32 -50.26,21.39 -50.18,21.46 -45.23,21.46 | IC3.32 | IC3.32 -50.26,19.48 -51.07,18.67 | -43.73,36.35 -43.7,36.32
  Top 0.305: IC1.1 -86.25,15.49 | -52.67,35.1 -52.77,35.2 IC3.99 | IC3.11 -55.2,29.35 -55.18,29.36 -53.74,29.36 | -53.74,29.36 -53.66,29.36 | -42,27.86 -41.98,27.84 -39.25,27.84 | -39.23,27.84 -39.24,27.85 IC3.62 -39.25,27.84 | -43.76,37.28 -42.81,38.23 v-42.81,38.86 | -53.74,29.36 -53.74,29.34 -53.71,29.36 -53.63,29.36 | v-59.71,29.23 -59.45,30.48 | -38.12,27.81 -38.14,27.84 -39.25,27.84 | v-79.24,33.68 -78.83,33.68 | C15.2 -75.58,29.46 -76.6,30.48 -78.12,30.48 -78.87,31.23 IC4.3 | IC4.33 -78.12,33.32 v-79.24,33.68 | v-79.24,33.68 -78.87,33.31 | -78.87,32.33 -78.87,33.32 v-79.24,33.68 | RN5.4 -78.97,17.99 -79.52,18.54 -79.9,18.54 v-80.15,18.8
  Top 0.406: C4.2 -58.18,6.48 -57.8,6.1 -57.8,3.94 POWER.6 | -42,27.86 -42.05,27.81 v-42.18,27.94 | v-52.85,33.4 -52.85,34.92 -52.67,35.1
  Top 0.61: v-42.18,27.94 -42.18,27.81 | -53.63,29.36 v-52.97,28.7
  Top 0.813: XIO.35 XIO.36
  Bottom 0.305: GROUND.2 -87.9,33.02
  Bottom 0.406: v-52.97,28.7 -52.97,29.08 | v-42.81,38.86 -42.81,37.97 -43.58,37.21 | v-42.18,27.94 -43.58,29.34
  Bottom 0.813: v-37.23,31.37 -38.19,31.37 -39.08,30.48 -39.13,30.48 -41.67,27.94 v-42.18,27.94 | -4.33,7.87 XIO.35
  Bottom 1.016: POWER.7 -54.88,5.08
  other vias: -29.06,20 -59.83,21.21 -65.67,33.66 -10.43,38.61 -7.89,21.59 -25.57,35.71 -74.44,11.68 -84.47,13.97 -65.8,16.38 -57.29,21.21 -81.04,46.23 -72.53,24.26 -39.77,41.4 -20.56,47.8 -53.23,40.13 -53.36,27.31 -49.67,5.67 -72.28,3.43 -84.85,22.1 -73.93,26.54 -72.91,43.31 -37.23,27.81 -40.02,20.45 -86,28.19 -60.34,24.64 -20.08,27.69 -21.35,18.04 1.75,31.75 -18.18,23.88 -28.21,23.5 -25.54,27.18 -79.64,26.03 -28.35,32.1 -35.06,20 1.75,16.51 -32.02,50.8 -54.39,50.8 -84.09,32.26 -33.7,38.89 -29.35,26.54 -60.72,17.02 -66.18,20.83 -75.71,22.22 -52.09,10.49
L13
  Top 0.203: RN3.7 -67.05,39.77 -66.56,40.26 -65.17,40.26 -64.79,39.88 -64.79,22.99 -63.39,21.59 -63.39,20.19 -63.77,19.81 -75.2,19.81 -76.09,20.7 | IC7.2 -76.27,21.01 -76.09,20.83 -76.09,20.7 | IC7.1 -76.26,20.36 -76.09,20.57 -76.09,20.7
LED  (via drill 0.41)  (1 unrouted)
  Top 0.203: -62.91,20.22 -60.47,20.22 | -60.47,20.22 -53.96,20.22 -53.84,20.34 IC3.26 | v-67.2,40.77 -64.91,40.77 -64.28,40.13 -64.28,23.24 -62.91,21.87 -62.91,20.22 | -60.47,20.22 -60.49,20.19 | IC7.3 -77.6,21.59 -78.25,21.59 -78.63,21.21 -78.63,20.19 -77.74,19.3 -63.64,19.3 -62.91,20.04 -62.91,20.22
  Bottom 0.254: -68.85,49.53 -71.39,46.99 -71.39,45.09 -69.48,43.18 -69.48,43.05 v-67.2,40.77
M8RXD
  Top 0.254: -70.81,30.73 RN4.7 | IC4.9 -72.81,33.05 -72.66,32.89
  Top 0.305: -70.81,30.73 -71.39,30.73 -71.77,30.99 -71.77,31.88 -72.66,32.89
M8TXD
  Top 0.254: -73.23,32.45 -73.86,32.45 -73.96,32.35 IC4.8
  Top 0.305: -73.23,32.45 -72.53,31.75 -72.53,30.86 -71.64,29.97 -70.85,29.97 RN4.8
MISO  (via drill 0.41)  (1 unrouted)
  Top 0.203: IC3.22 -53.71,23.85 -53.48,23.62 v-53.48,22.99 | v-17.03,8.76 -17.03,9.14 -18.05,10.16 -20.21,10.16 -20.97,9.4 -24.53,9.4 -25.47,10.34 -45.94,10.34 -47.64,8.64 v-49.04,8.64
  Bottom 0.203: v-17.03,8.76 -16.91,8.76 -15.13,6.98 -8.4,6.98 -6.87,5.46 -1.16,5.46 -0.02,6.6 -0.02,10.54 -0.91,11.43 -2.81,11.43 XIO.31 | v-53.48,22.99 -52.97,22.99 -52.34,22.35 -51.96,22.35 -50.94,21.34 -50.94,10.29 -49.29,8.64 v-49.04,8.64 | AVRISP6.1 -33.09,29.13 -33.09,27.38 -32.96,27.25 -32.96,18.72 -30.88,16.64
  Bottom 0.254: v-17.03,8.76 -17.03,9.27 -17.54,9.78 -20.08,9.78 -20.72,9.14 -22.49,9.14 -23.13,9.78 -23.13,11.18 -23.89,11.94 | -28.59,16.64 -30.88,16.64
  Bottom 0.305: -23.89,11.94 -28.59,16.64
MISO2
  Top 0.254: IC4.17 -76.37,38.96 -75.83,39.5 -75.83,45.34 -77.23,46.74 ICSP1.1
MOSI  (via drill 0.41)  (1 unrouted)
  Top 0.203: IC3.21 -56.82,24.35 -57.04,24.13 v-58.18,24.13 | XIO.32 -0.27,11.43 -0.27,9.53 -0.91,8.89 -5.35,8.89 -7.25,10.79 -20.59,10.79 -21.22,10.16 v-22.24,10.16 -22.37,10.03 -24.4,10.03 -25.16,10.79 -46.72,10.79 v-47.39,10.12
  Bottom 0.203: v-58.18,24.13 -57.04,24.13 -56.4,24.64 -53.99,24.64 -52.21,22.86 -51.7,22.86 -50.43,21.59 -50.43,10.54 -49.29,9.4 -48.11,9.4 v-47.39,10.12 | AVRISP6.4 -31.64,27.94 -30.75,27.05
  Bottom 0.254: -30.75,27.05 -30.75,24.76 -32.4,23.11 -32.4,19.1 -30.57,17.27
  Bottom 0.305: -30.57,17.27 -28.21,17.27 -22.24,11.3 v-22.24,10.16
MOSI2  (via drill 0.41)
  Top 0.254: v-75.58,46.35 -75.2,45.97 -75.2,39.37 -75.71,38.86 -75.71,36.7 -75.67,36.61 IC4.16
  Bottom 0.254: ICSP1.4 -79.26,44.96 -77.99,46.23 -75.83,46.23 -75.71,46.35 v-75.58,46.35
N$1  (1 unrouted)
N$2
  Top 0.254: RN3.2 -70.3,39.82 -70.12,40 -70.12,41.66 -69.87,41.91 L.A
N$3  (via drill 0.41)
  Top 0.203: -20.84,37.08 ON.A | v-17.92,46.74 -18.05,46.74 -18.94,45.85 -37.1,45.85 v-37.99,46.74
  Top 0.254: v-67.58,46.74 -67.07,46.23 -67.07,42.16 -68.72,40.51 -69.17,40.51 RN3.8 | -20.84,37.08 -20.84,37.37 v-22.1,38.62
  Bottom 0.203: v-22.1,38.62 -17.92,42.8 v-17.92,46.74 | v-37.99,46.74 -38.62,46.74 -40.4,48.51 -46.37,48.51 -47.77,47.12 -53.36,47.12 -54.5,45.97 -66.82,45.97 v-67.58,46.74
N$7  (1 unrouted)
N$46  (2 unrouted)
N$47  (1 unrouted)
N$48  (1 unrouted)
N$49  (1 unrouted)
N$50  (1 unrouted)
N$52  (1 unrouted)
N$54
  Top 0.254: RN4.4 -69.44,33.82 RX.A
N$55
  Top 0.254: RN4.3 -68.58,31.51 -67.83,32.26 -67.83,35.18 -69.07,36.41 TX.A
N$56  (1 unrouted)
N$58  (1 unrouted)
N$59  (2 unrouted)
N$60  (2 unrouted)
N$61  (1 unrouted)
N$62  (1 unrouted)
N$63  (1 unrouted)
N$64  (1 unrouted)
N$65  (1 unrouted)
N$66  (1 unrouted)
N$67  (1 unrouted)
N$68  (2 unrouted)
N$69  (2 unrouted)
N$70  (1 unrouted)
N$71  (2 unrouted)
N$72  (1 unrouted)
N$73  (1 unrouted)
N$74  (2 unrouted)
N$75  (1 unrouted)
N$76  (1 unrouted)
N$77  (1 unrouted)
N$78  (1 unrouted)
N$79  (1 unrouted)
N$80  (1 unrouted)
N$81  (1 unrouted)
N$82  (1 unrouted)
N$83  (1 unrouted)
N$84  (1 unrouted)
N$85  (1 unrouted)
N$86  (1 unrouted)
N$87  (1 unrouted)
N$88  (1 unrouted)
N$89  (1 unrouted)
N$90  (1 unrouted)
N$91  (1 unrouted)
N$92  (1 unrouted)
N$93  (1 unrouted)
N$94  (1 unrouted)
N$95  (1 unrouted)
N$96  (2 unrouted)
N$97  (2 unrouted)
N$98  (2 unrouted)
N$99  (2 unrouted)
N$100  (2 unrouted)
PA0
  Top 0.203: IC3.78 -42.26,37.89 -41.8,38.35 -41.8,43.18 -39.64,45.34 -7.76,45.34 -4.84,48.26 XIO.3
PA1
  Top 0.203: -41.76,37.63 -41.29,38.1 -41.29,42.93 -39.39,44.83 -7.25,44.83 -5.1,46.99 -2.81,46.99 XIO.4
PA2  (1 unrouted)
  Top 0.203: XIO.5 -5.35,45.72 -6.75,44.32 -39.13,44.32 -40.78,42.67 -40.78,37.85
PA3
  Top 0.203: XIO.6 -2.81,44.45 -5.86,44.45 -6.49,43.81 -36.08,43.81 -36.72,43.18 -36.72,39.26 -38.62,37.35 -38.62,34.67 -38.95,34.35
PA4
  Top 0.203: -38.31,33.85 -38.12,34.04 -38.12,37.23 -36.21,39.13 -36.21,42.8 -35.7,43.31 -5.48,43.31 -5.35,43.18 XIO.7
PA5
  Top 0.203: -38.04,33.35 -37.61,33.78 -37.61,36.97 -35.7,38.88 -35.7,42.29 -35.19,42.8 -6.49,42.8 -5.6,41.91 -2.81,41.91 XIO.8
PA6
  Top 0.203: -37.78,32.85 -37.1,33.53 -37.1,36.72 -35.19,38.62 -35.19,41.91 -34.81,42.29 -7.25,42.29 -5.6,40.64 XIO.9
PA7
  Top 0.203: -37.52,32.35 -36.59,33.27 -36.59,36.47 -34.69,38.37 -34.69,41.4 -34.31,41.78 -8.02,41.78 -5.6,39.37 -2.81,39.37 XIO.10
PB0  (via drill 0.41)
  Top 0.203: v-52.85,25.4 -52.67,25.35 | v-48.66,11.56 -48.53,11.56 -48.28,11.81 -5.73,11.81 -5.35,11.43 -2.81,11.43 XIO.34
  Bottom 0.203: v-52.85,25.4 -52.72,25.4 -49.42,22.1 -49.42,12.19 v-48.66,11.56
PC0
  Top 0.203: -36.57,23.35 -35.32,22.1 -17.03,22.1 -9.92,29.21 -2.81,29.21 XIO.18
PC1
  Top 0.203: -36.31,23.85 -35.19,22.61 -17.54,22.61 -9.67,30.48 XIO.17
PC2
  Top 0.203: -36.05,24.35 -34.81,23.11 -29.99,23.11 -28.08,25.02 -16.02,25.02 -9.29,31.75 -2.81,31.75 XIO.16
PC3
  Top 0.203: -35.78,24.85 -34.56,23.62 -30.24,23.62 -28.34,25.53 -16.53,25.53 -9.03,33.02 XIO.15
PC4
  Top 0.203: -36.21,25.35 -35.07,26.48 -30.67,26.48 -28.08,29.08 -14.24,29.08 -9.03,34.29 -2.81,34.29 XIO.14
PC5
  Top 0.203: -36.4,25.85 -35.4,26.86 -31.08,26.86 -28.21,29.72 -14.49,29.72 -8.65,35.56 XIO.13
PC6
  Top 0.203: -36.53,26.35 -35.58,27.31 -35.58,28.7 -35.27,29.02 -29.78,29.02 -28.44,30.35 -14.88,30.35 -8.4,36.83 -2.81,36.83 XIO.12
PC7
  Top 0.203: -36.67,26.85 -36.08,27.43 -36.08,28.83 -35.5,29.4 -30.19,29.4 -28.74,30.86 -15.38,30.86 -8.14,38.1 XIO.11
PD7
  Top 0.203: XIO.19 -10.05,27.94 -16.4,21.59 -37.76,21.59 -37.76,21.56 -38.37,20.95 -38.37,20.57 -39.89,19.05 -40.02,19.05 -40.66,18.41 -41.16,18.41 -41.26,18.51
PE0  (via drill 0.41)
  Top 0.203: -36.59,48.77 -39.64,48.77 -41.29,47.12 -46.75,47.12 -48.4,45.47 -52.21,45.47 -52.34,45.34 -57.29,45.34 -57.67,44.96 -57.67,36.7 v-57.42,36.45 -55.9,34.92 -54.5,34.92 -54.12,34.54 -54.12,34.04 -54.31,33.85
  Top 0.254: v-67.45,37.47 -67.52,37.4 -67.52,35.74 -67.2,35.43 -67.2,31.88 -68.34,30.73 -69.43,30.73 RN4.2
  Bottom 0.254: v-67.45,37.47 -58.44,37.47 v-57.42,36.45
PE1  (via drill 0.41)
  Top 0.203: v-57.67,35.18 -58.18,35.69 -58.18,45.09 -57.42,45.85 -52.72,45.85 -52.59,45.97 -48.78,45.97 -47.13,47.62 -41.55,47.62 -39.89,49.28 -38.37,49.28 -37.1,50.55 | v-58.44,33.53 -58.18,33.27 -58.11,33.35
  Top 0.254: RN4.1 -68.14,29.91 -66.56,31.5 v-66.56,36.32
  Bottom 0.203: v-57.67,35.18 -57.67,34.29 v-58.44,33.53
  Bottom 0.254: v-66.56,36.32 -58.82,36.32 v-57.67,35.18
PG0  (via drill 0.41)
  Top 0.203: v-39,21.46 -39.26,21.84 | XIO.22 -2.81,24.13 -9.92,24.13 -13.99,20.07 -26.3,20.07 -27.96,18.41 -38.37,18.41 -38.62,18.67 v-39,18.67
  Bottom 0.203: v-39,18.67 v-39,21.46
PG1  (via drill 0.41)
  Top 0.203: v-37.23,22.48 -37.62,22.85 | XIO.21 -9.92,25.4 -14.75,20.57 -26.94,20.57 -28.46,19.05 -37.73,19.05 -38.12,19.43 v-38.12,19.56
  Bottom 0.203: v-38.12,19.56 -37.48,19.56 -36.72,20.32 -36.72,21.97 v-37.23,22.48
PG2  (via drill 0.41)
  Top 0.203: -38.26,31.85 -38.14,31.72 -38.14,29.49 v-37.73,29.08 | v-37.48,20.7 -36.97,20.7 -36.59,21.08 -15.51,21.08 -9.92,26.67 -2.81,26.67 XIO.20
  Bottom 0.203: v-37.48,20.7 -37.86,20.7 -38.12,20.95 -38.12,28.57 v-37.73,29.08
PH4
  Top 0.203: IC3.16 -60.9,26.85 -61.23,27.18 -61.23,45.85 -58.18,48.9 -54.37,48.9 -52.47,50.8 PWML.8
PL0
  Top 0.203: -48.78,20.29 -48.78,14.22 -46.88,12.32 -7.76,12.32 -6.11,13.97 -2.81,13.97 XIO.30
  Top 0.254: -48.76,20.35 -48.76,20.32 -48.78,20.29
PL1
  Top 0.203: -48.26,14.46 -46.62,12.83 -8.52,12.83 -6.11,15.24 XIO.29
PL2
  Top 0.203: -47.77,20.29 -47.77,14.99 -46.12,13.34 -9.16,13.34 -5.98,16.51 -2.81,16.51 XIO.28
  Top 0.254: -47.77,20.35 -47.79,20.32 -47.77,20.29
PL3
  Top 0.203: -47.26,15.49 -45.61,13.84 -9.79,13.84 -5.86,17.78 XIO.27
PL4
  Top 0.203: -46.75,20.22 -46.75,15.75 -45.35,14.35 -10.43,14.35 -5.73,19.05 -2.81,19.05 XIO.26
  Top 0.254: -46.76,20.28 -46.73,20.24 -46.75,20.22
PL6
  Top 0.203: -45.74,20.24 -45.74,16.51 -44.59,15.37 -11.57,15.37 -5.35,21.59 -2.81,21.59 XIO.24
  Top 0.254: -45.76,20.32 -45.79,20.29 -45.74,20.24
PL7
  Top 0.203: -45.26,17.05 -44.08,15.88 -12.33,15.88 -5.35,22.86 XIO.23
PWRIN
  Top 1.016: D1.A -79.77,2.79 -81.04,4.06 -81.04,4.19 -82.69,5.84 -82.82,5.84 -84.6,7.62 -85.69,7.62 X1.2
RD+
  Top 0.254: RN2.4 -84.66,38.28 -84.47,38.1 -84.47,37.97 -83.58,37.08 -83.58,36.07 -82.06,34.55 IC4.29
RD-
  Top 0.254: RN2.1 -84.78,35.85 -84.56,35.85 -84.09,35.38 -84.09,35.05 -83.09,34.05 IC4.30
RESET  (via drill 0.41)  (1 unrouted)
  Top 0.254: -51.26,19.44 -51.53,19.18 -53.86,19.18 -54.37,19.69 | -33.21,24.18 -30.44,24.18 -28.59,26.03 -19.32,26.03 v-18.05,27.31 | -69.27,17.87 -69.91,17.87 -70.75,17.02 -70.75,15.88 RESET-EN.1
  Top 0.305: POWER.3 -65.04,7.87 v-66.56,9.4 | -51.26,19.44 IC3.30 | AVRISP6.5 -33.21,24.18 | -54.37,19.69 -61.86,19.69 -62.5,19.05 -62.5,18.8 | v-18.05,32.13 -21.63,32.13 | -69.27,17.87 C7.2 | RESET-EN.1 RESET-EN.2 | RESET-EN.1 -70.75,15.37 | -62.5,18.8 D3.A -63.72,16.31 C1.1 | RESET-EN.2 -69.36,16.64 -67.2,18.8 -62.5,18.8 | RN5.1 -71.32,15.31 RESET-EN.1 | RESET-EN.2 -69.36,12.83 v-69.99,12.19
  Top 0.406: v-51.2,8.26 -50.18,8.25 -49.55,7.62 -48.53,7.62 -48.15,8 -47.51,8 -45.63,9.83 -25.97,9.83 -24.78,8.64 -19.57,8.64 v-19.45,8.76
  Bottom 0.254: -34.31,25.27 -33.8,24.76 -33.8,17.78 -31.38,15.37
  Bottom 0.305: v-19.45,8.76 -19.95,8.76 -20.08,8.64 -23.13,8.64 -29.86,15.37 -31.38,15.37 | -34.31,25.27 AVRISP6.5 | v-51.2,8.26 -52.34,9.27 -66.44,9.27 v-66.56,9.4 -67.2,9.4 v-69.99,12.19 | v-18.05,27.31 v-18.05,32.13
RESET2  (via drill 0.41)
  Top 0.254: IC4.24 -81.55,38.93 -81.55,39.12 | RN5.7 -80.68,16.11 v-81.55,15.24
  Top 0.305: ICSP1.5 -83.07,47.5 | v-81.55,15.24 -81.48,15.31 | -81.55,39.12 -81.55,39.5 v-81.87,39.81 -81.8,39.75 -81.8,41.4 -83.71,43.31 -85.87,43.31 -86.5,43.94 -86.5,46.4 D2.A
  Top 0.61: D2.A -84.42,47.5 ICSP1.5
  Bottom 0.305: v-81.55,15.24 -81.3,15.24 -81.3,21.21 -78.63,23.75 -78.63,29.08 -77.49,30.23 -74.82,30.23 -74.56,30.48 -74.56,33.13 -79.91,38.48 -80.41,38.48 -81.61,39.69 v-81.87,39.81
RXL
  Top 0.254: -71.78,33.67 -72.3,33.67 -72.43,33.55 IC4.10
  Top 0.305: -71.78,33.67 RX.C
SCK  (via drill 0.41)  (1 unrouted)
  Top 0.203: IC3.20 -56.87,24.85 v-57.17,25.15 | XIO.33 -5.35,10.16 -6.49,11.3 -22.88,11.3 -23.26,10.92 v-24.15,10.92 -24.53,11.3 -47.51,11.3 -48.53,10.29 v-48.83,10.29
  Bottom 0.203: v-57.17,25.15 -53.86,25.15 -52.09,23.37 -51.45,23.37 -49.93,21.84 -49.93,10.92 -49.29,10.29 v-48.83,10.29 | -34.31,27.94 -33.37,27 -33.37,18.31 -31.06,16
  Bottom 0.254: -34.31,27.94 AVRISP6.3
  Bottom 0.305: -31.06,16 -29.23,16 v-24.15,10.92
SCK2
  Top 0.254: ICSP1.3 -78.63,48.64 -75.83,48.64 -74.56,47.37 -74.56,39.24 -75.2,38.61 -75.2,37.85 -74.56,37.21 -74.56,36.45 -74.97,36.05 IC4.15
SCL  (via drill 0.41)  (2 unrouted)
  Top 0.203: IC3.43 -44.76,17.31 -43.83,16.38 -23.38,16.38 -23,16.76 v-22.75,16.89 | v-56.53,42.67 v-52.97,42.67
  Top 0.254: -17.52,37.23 -17.41,37.34 -17.41,38.86
  Top 0.305: v-16.65,39.12 -17.16,39.12 -17.41,38.86
  Bottom 0.203: -11.7,48.9 -12.33,48.9 -14.24,46.99 -14.24,43.18 -16.65,40.77 v-16.65,39.12 -18.05,39.12 -22.88,34.29 -22.88,17.02 v-22.75,16.89 -23.38,16.26 -25.54,16.26 -27.32,18.03 -27.32,44.58 -31,48.26 -33.16,48.26 -36.97,44.45 -40.27,44.45 -42.05,46.23 -45.86,46.23 -47.01,45.09 -50.69,45.09 -52.72,42.93 v-52.97,42.67 | -79.26,50.29 -78.25,49.28 -75.83,49.28 -72.41,45.85 -72.41,43.94 -67.83,39.37 -66.56,39.37 -65.42,40.51 -65.42,42.42 -63.64,44.2 -58.05,44.2 v-56.53,42.67
SDA  (via drill 0.41)  (2 unrouted)
  Top 0.203: v-24.02,17.65 -24.78,16.89 -43.58,16.89 -44.21,17.53 -44.21,19.94 -44.26,20.04 -44.26,20.15 IC3.44 | v-56.53,44.32 v-52.97,44.32
  Top 0.305: v-19.32,38.99 -19.32,36.83 -18.94,36.45 -18.11,36.45
  Bottom 0.203: -14.24,49.53 -15.51,48.26 -15.51,42.8 v-19.32,38.99 -23.38,34.92 -23.38,18.92 -24.02,18.29 v-24.02,17.65 -24.02,17.02 -24.27,16.76 -25.42,16.76 -26.81,18.16 -26.81,44.7 -30.88,48.77 -33.29,48.77 -37.1,44.96 -39.77,44.96 -41.67,46.86 -45.99,46.86 -47.26,45.59 -51.7,45.59 v-52.97,44.32 | -76.6,50.8 -71.9,46.1 -71.9,44.2 -67.58,39.88 -66.82,39.88 -65.93,40.77 -65.93,42.67 -63.9,44.7 -56.91,44.7 v-56.53,44.32
THERM0  (via drill 0.41)  (3 unrouted)
  Top 0.203: IC3.84 -45.26,37.81 -44.85,38.23 -44.85,40.77 -44.34,41.28 -44.34,42.42 -43.96,42.8 v-43.96,44.2
  Bottom 0.203: v-43.96,44.2 -43.96,42.8 -44.34,42.42 -44.34,41.28 -44.85,40.77 -44.85,38.23 -45.23,37.85 -45.23,27.18 -42.18,24.13 -42.18,16.13 -39.64,13.59 -30.88,13.59 -24.15,6.86 -17.8,6.86 -16.02,5.08 -12.84,5.08 -11.7,3.94
THERM1  (via drill 0.41)  (3 unrouted)
  Top 0.203: IC3.83 -44.76,37.68 -44.34,38.1 -44.34,40.51 -43.45,41.4 v-43.45,42.04
  Bottom 0.203: v-43.45,42.04 -43.45,41.4 -44.34,40.51 -44.34,38.1 -44.72,37.72 -44.72,27.31 -41.67,24.26 -41.67,16.38 -39.51,14.22 -30.62,14.22 -23.76,7.37 -17.41,7.37 -15.76,5.72 -10.81,5.72 -9.16,4.06
THERM2  (via drill 0.41)  (3 unrouted)
  Top 0.203: IC3.82 -44.26,37.54 -43.83,37.97 -43.83,39.88 v-43.45,40.26
  Bottom 0.203: v-43.45,40.26 -43.83,39.88 -43.83,37.97 -44.21,37.59 -44.21,27.43 -41.16,24.38 -41.16,16.64 -39.39,14.86 -30.37,14.86 -23.38,7.87 -17.03,7.87 -15.51,6.35 -9.03,6.35 -6.62,3.94
TXL
  Top 0.254: TX.C -71.26,36.83 -74.05,34.05 IC4.11
UGND
  Top 0.254: IC4.28 -81.67,35.05 -82.95,36.32
  Top 0.406: -82.95,36.32 -82.95,37.85 -83.71,38.61
  Top 0.61: L1.1 -87.18,43.69 -87.18,42.59 C10.2 -86.97,42.12 -85.94,41.07 -84.17,41.07 -83.71,40.51 -83.71,38.61
  Top 0.813: X2.4 -91.56,36.83 -92.98,36.83 -93.61,37.47 -93.61,40.51 -90.31,43.81 -89.8,43.81 -88.79,44.83 -88.79,45.13 L1.1
  Bottom 0.813: X2.4 -91.54,36.53 GROUND.1
USBVCC
  Top 0.254: IC4.31 -82.16,33.55 -82.95,32.77 -82.95,32 -83.71,31.24
  Top 0.305: -83.71,31.24 -84.85,31.24 C8.1
  Top 0.406: C8.1 -85.11,31.5 -85.74,32.13 -87.27,32.13 -87.9,31.5 -87.9,28.57 -86.5,27.18 -86.5,25.88
  Top 0.61: -86.5,25.88 T1.1 -91.09,24.72 F1.1
USHIELD  (via drill 0.41)
  Top 0.813: X2.P$2 -94.25,33.02 -92.98,33.02 -92.34,33.66 -88.27,33.66 Z1.1 | Z2.1 -87,40.24 -88.41,41.66 v-88.41,43.18 | L1.2 -93.14,45.21 X2.P$1
  Bottom 0.813: v-88.41,43.18 -93.08,43.18 X2.P$1
  Bottom 1.27: X2.P$2 -94.25,33.02 -96.16,34.92 -96.16,41.28 -94.25,43.18 X2.P$1
VCC  (44 unrouted)
VIN  (via drill 0.41)
  Top 0.203: -86.29,20.06 IC1.3
  Top 0.305: RN5.6 -82.08,16.91 -82.31,17.15
  Top 0.813: v-74.06,7.37 -75.47,7.37 PC1.+ -81.03,11.54 -82.82,13.34 -82.82,15.75 -82.31,16.26 -82.31,17.15 C2.1 -85.23,20.06 -86.29,20.06
  Top 1.016: D1.C -74.06,3.01 v-74.06,7.37
  Bottom 1.27: v-74.06,7.37 -73.55,7.75 -73.17,7.37 -53.74,7.37 -52.34,5.97 POWER.8
VUCAP
  Top 0.254: -82.95,38.86 -82.31,38.23 -82.31,36.45 -81.41,35.55 IC4.27
  Top 0.305: C10.1 -84.89,42.42 -83.84,42.42 -82.95,41.53 -82.95,38.86
X-DIR  (via drill 0.41)  (1 unrouted)
  Top 0.203: IC3.96 -51.26,37.66 -51.58,37.97 -51.58,39.24 -51.96,39.62 v-51.96,40
  Bottom 0.203: -44.72,9.6 -48.43,13.31 -48.43,22.56 -51.32,25.45 -51.32,37.72 -51.58,37.97 -51.58,39.24 -51.96,39.62 v-51.96,40
X-EN  (2 unrouted)
X-MAX  (1 unrouted)
  Top 0.203: IC3.6 -59.04,31.85 -59.71,32.51 -59.71,45.47 -57.8,47.37 -53.61,47.37 -52.59,48.39 -51.58,48.39 -51.2,48.77 -41.42,48.77 -39.64,50.55
X-MIN  (1 unrouted)
X-STEP  (via drill 0.41)  (1 unrouted)
  Top 0.203: IC3.97 -51.76,37.52 -52.59,38.35 v-52.59,38.86
  Bottom 0.203: -47.26,3.3 -45.35,5.21 -45.35,9.4 -48.91,12.95 -48.91,22.35 -51.83,25.27 -51.83,37.59 -52.59,38.35 v-52.59,38.86
XT1
  Top 0.254: -80.26,29.34 R2.1 -79.87,30 IC4.1
  Top 0.305: C14.1 -81.93,26.29 Y2.2
  Top 0.406: C14.1 R2.1
XT2
  Top 0.254: IC4.2 -79.37,29.95 R2.2 | C15.1 -77.36,26.29 Y2.1
  Top 0.406: C15.1 R2.2
XTAL1
  Top 0.203: IC3.34 -49.26,18.8 -50.53,17.53 -55.52,17.53
  Top 0.254: Y1.3 -58.17,13.6 R1.1 -57.17,13.72 -56.4,14.48 -56.4,16.89 -55.77,17.53 -55.52,17.53
XTAL2
  Top 0.203: -54.75,18.03 -54.65,17.93 -51,17.93 -49.76,19.18 IC3.33
  Top 0.254: -60.23,15.6 Y1.1 -60.1,15.6 -59.99,15.49 R1.2 -57.04,16 -57.04,17.15 -56.15,18.03 -54.75,18.03
XVCC
  Top 0.61: F1.2 -95.56,28.62 -96.54,29.59 -96.54,34.54 -96.16,34.92 -91.47,34.92 X2.1
Y-DIR  (via drill 0.41)  (1 unrouted)
  Top 0.203: IC3.90 -48.26,38.62 -47.89,38.99 -47.89,39.62 -48.4,40.13 -48.4,41.15 -47.64,41.91 v-47.64,42.29
  Bottom 0.203: v-47.64,42.29 -47.64,41.91 -48.4,41.15 -48.4,40.13 -47.89,39.62 -47.89,38.99 -48.28,38.61 -48.28,26.42 -45.23,23.37 -45.23,14.6 -36.59,5.97 -35.83,5.97 -34.94,5.08 -33.92,5.08 -33.29,4.44 -30.75,4.44 -29.48,3.17 -29.48,3.94
Y-EN  (via drill 0.41)  (2 unrouted)
  Top 0.203: v-51.07,40.89 -51.07,38.1 -50.79,37.82 -50.79,36.68 -50.69,36.58 -50.76,36.5 -50.76,36.38 -50.79,36.35 | -50.79,36.35 -50.82,36.32 | -50.79,36.35 IC3.95
  Bottom 0.203: v-51.07,40.89 -51.07,38.1 -50.79,37.82 -50.79,25.63 -47.84,22.68 -47.84,13.46 -42.18,7.8
Y-MAX  (1 unrouted)
Y-MIN  (1 unrouted)
Y-STEP  (via drill 0.41)  (1 unrouted)
  Top 0.203: IC3.91 -48.76,39.35 v-48.78,39.37
  Bottom 0.203: v-48.78,39.37 -48.78,26.29 -45.74,23.24 -45.74,14.48 -36.59,5.21 -35.83,5.21 -35.07,4.44 -33.92,4.44
Z-DIR  (1 unrouted)
Z-EN  (via drill 0.41)  (2 unrouted)
  Top 0.203: IC3.89 -47.76,38.49 -47.39,38.86 -47.39,40.26 v-47.64,40.51
  Bottom 0.203: v-47.64,40.51 -47.39,40.26 -47.39,38.86 -47.77,38.48 -47.77,26.54 -44.72,23.5 -44.72,14.86 -36.34,6.48 -35.58,6.48 -34.81,5.72 -33.92,5.72 -33.16,4.95 -28.08,4.95 -26.3,3.17 -24.4,3.17
Z-MAX  (via drill 0.41)  (1 unrouted)
  Top 0.203: IC3.45 -43.73,20.35 -43.7,20.32 -43.7,18.29 -42.76,17.35 -26.1,17.35 v-25.42,17.91
  Bottom 0.203: -16.78,42.67 -23.89,35.56 -23.89,19.56 v-25.42,17.91
Z-MIN  (via drill 0.41)  (1 unrouted)
  Top 0.203: IC3.46 -43.26,20.26 -43.2,20.19 -43.2,18.67 -42.43,17.91 -27.32,17.91 v-26.05,19.18
  Bottom 0.203: v-26.05,19.18 -25.42,19.18 -24.4,20.07 -24.4,37.47 -19.32,42.54
Z-STEP  (1 unrouted)
(copper drawn outside any net)
  shapes: Top area x3

## Text on the board
Top: MEGAXL-Rev3b
tPlace: 9 | 8 | 7 | 6 | 5 | 4 | 3 | 2 | 1 | 0 | 22 | 13 | 12 | 11 | 10 | 14 | 15 | 16 | 17 | 18 | 19 | 20 | 21 | 24 | 26 | 28 | 30 | 31 | 32 | 33 | 34 | 35 | 36 | 37 | 38 | 39 | 40 | 41 | 42 | 43 | www.arduino.cc | 44 | 45 | 46 | 47 | TM | 48 | 49 | 50 | 51 | 52 | 53 | 0 | 1 | 2 | 3 | 4 | 5 | 6 | 7 | 8 | 9 | 10 | 11 | 12 | 13 | 14 | 15
tNames: SCL | SDA | M.Banzi | 5V | D.Cuartielles | T.Igoe | G.Martino | D.Mellis | GND | AREF | PWM | TX | RX | TX3 | RX3 | TX2 | RX2 | TX1 | RX1 | SDA | SCL | 1 | DIGITAL | Arduino | MEGA 2560 | ANALOG IN | IOREF | RESET | 3V3 | 5V | GND | VIN | GND
bNames: designed by | ITALY | tinker it
Document: 12-35V Out | - | D10 | + | - | D9 | + | - | D11 | + | 12-35VDC In | SERVOS | AUX-1 | AUX-2 | AUX-3 / SPI | + | D11 | D6 | D5 | D4 | 11A | A9 | A11 | SCK | MISO | 5V | GND | D2 | D1 | GND | D63 | D48 | D42 | D65 | GND | D52 | D50 | 5V | - | 5V | 5V | 5V | 5V | 5V | GND | A3 | A4 | 5V | A5 | A10 | D44 | A12 | NC | D53 | MOSI | D49 | D57 | D58 | D59 | D64 | D66 | D51 | + | GND | GND | GND | GND | 5A | Copyright 2011 Johnny Russell - UltiMachine | - | RAMPS 1.4 (RepRap Arduino MEGA Pololu Shield) | GPL v3 | reprap.org/wiki/RAMPS1.4 | Reversing input power, and inserting stepper drivers incorrectly will destroy electronics. | I2C | 21 | 20 | GND | 5V | AUX-4 | D16 | D17 | D23 | D25 | D27 | D29 | D31 | D33 | D35 | D37 | D38 | D41 | D43 | D45 | D47 | D32 | GND | 5V
Reference: L | ON | TX | RX | PC1 | PC2
_tsilk: + | I2C | END STOPS | 21 | + | E0 | 1 | S | 20 | D10 | 1 | - | - | E1 | + | + | + | D9 | T0 | T1 | T2 | + | 1 | + | D8 | 1 | 1 | 1 | U | X | Y | Z | + | + | - | 1 | + | PS | AUX-4 | AUX-1 | AUX-2 | AUX-3 | + | - | s | s | 1 | - | + | UltiMachine | GPL3 | 1 | SERVOS | 1 | reprap.org/wiki/RAMPS | V1.4 | -